# EAGLE design ATTinyAmpDriver (EAGLE 6.4)
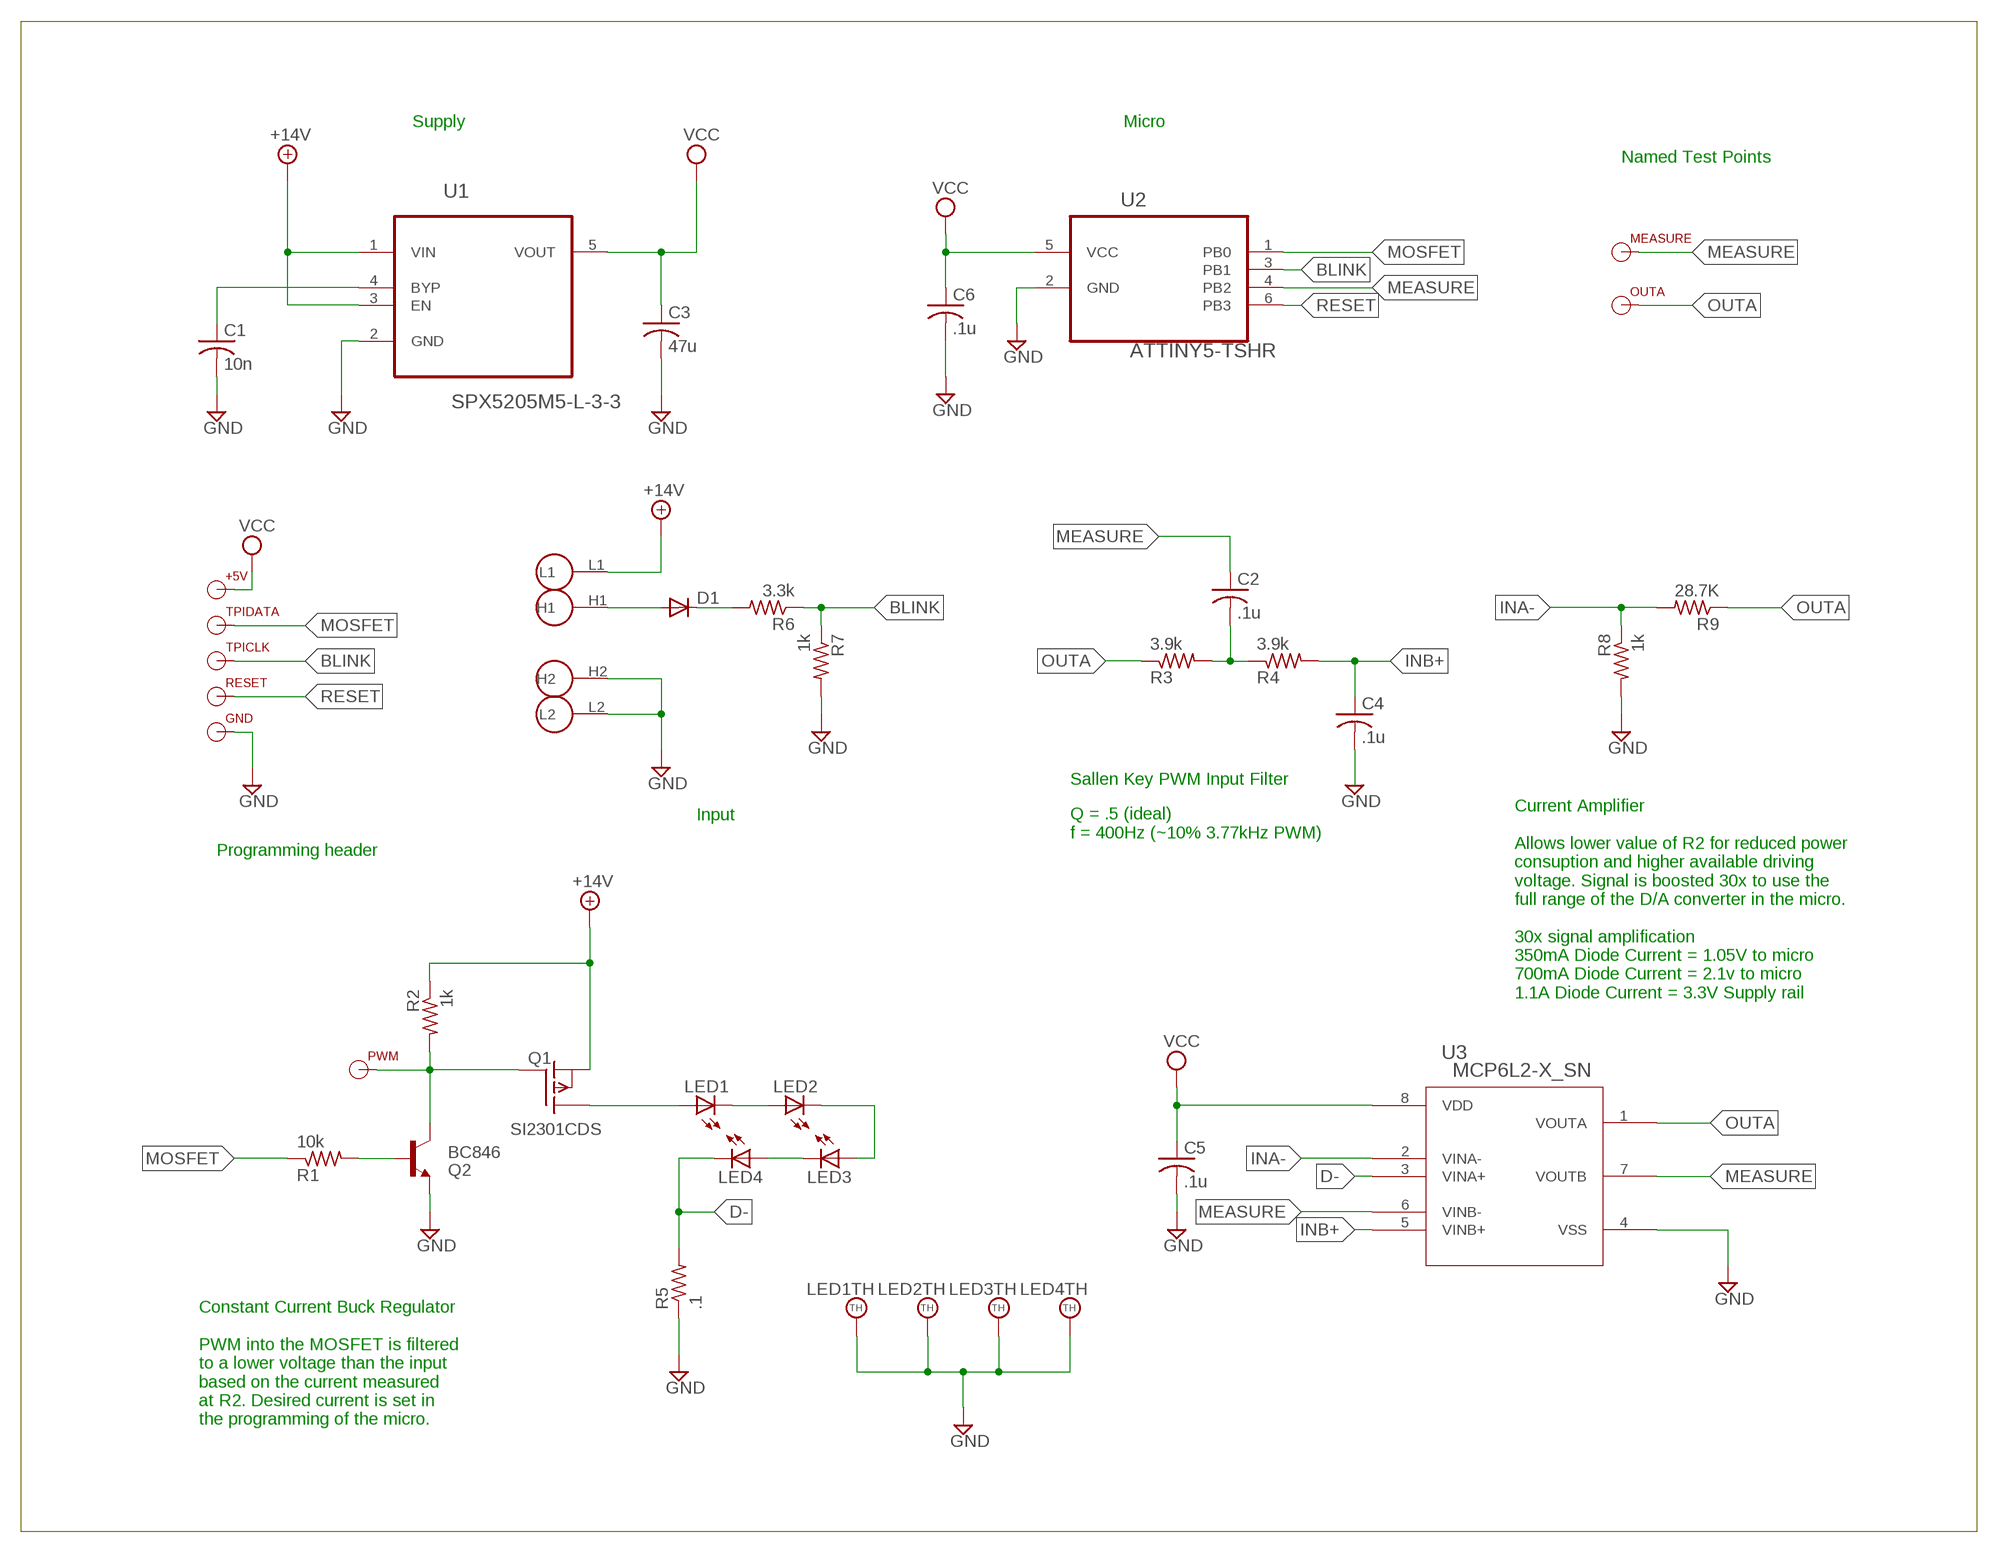
[diagram p0: schematic, sheet 1]

## Parts
+5V  TPI  [TPI_PAD]
C1  10n  C-USC0603  [C0603]
C2  .1u  C-USC0603  [C0603]
C3  47u  C-USC1206  [C1206]
C4  .1u  C-USC0603  [C0603]
C5  .1u  C-USC0603  [C0603]
C6  .1u  C-USC0603  [C0603]
D1  DIODE_0603  [D0603]
GND  TPI  [TPI_PAD]
LED1  LUXEON_REBELCREE_XP-E  [CREE_XP-E]
LED2  LUXEON_REBELCREE_XP-E  [CREE_XP-E]
LED3  LUXEON_REBELCREE_XP-E  [CREE_XP-E]
LED4  LUXEON_REBELCREE_XP-E  [CREE_XP-E]
MEASURE  TPI  [TPI_PAD]
OUTA  TPI  [TPI_PAD]
PWM  TPI  [TPI_PAD]
Q1  SI2301CDS  [SOT-23_POWER]
Q2  BC846  [SOT23]
R1  10k  R-US_R0603  [R0603]
R2  1k  R-US_R0603  [R0603]
R3  3.9k  R-US_R0603  [R0603]
R4  3.9k  R-US_R0603  [R0603]
R5  .1  R-US_R1206  [R1206]
R6  3.3k  R-US_R0603  [R0603]
R7  1k  R-US_R0603  [R0603]
R8  1k  R-US_R0603  [R0603]
R9  28.7K  R-US_R0603  [R0603]
RESET  TPI  [TPI_PAD]
TPICLK  TPI  [TPI_PAD]
TPIDATA  TPI  [TPI_PAD]
U1  SPX5205M5-L-3-3  [SOT95P280X145-5N]
U2  ATTINY5-TSHR  [SOT95P280X145-6N]
U3  MCP6L2-X_SN  [SOIC8-N_MC]
U$1  CON_TAILLIGHT  [TAILLIGHT]

## Nets
+14V: Q1.P$2(S) R2.1 U1.1(VIN) U1.3(EN) U$1.L1
BLINK: R6.1 R7.1 TPICLK.P$1(TPI_PIN) U2.3(PB1)
CROSSOVER: LED2.CT(C) LED3.AN(A)
D-: LED4.CT(C) R5.2 U3.3(VINA+)
GND: C1.2 C3.2 C4.2 C5.2 C6.2 GND.P$1(TPI_PIN) LED1.TH LED2.TH LED3.TH LED4.TH Q2.2(E) R5.1 R7.2 R8.2 U1.2(GND) U2.2(GND) U3.4(VSS) U$1.H2 U$1.L2
INA-: R8.1 R9.2 U3.2(VINA-)
INB+: C4.1 R4.2 U3.5(VINB+)
MEASURE: C2.1 MEASURE.P$1(TPI_PIN) U2.4(PB2) U3.6(VINB-) U3.7(VOUTB)
MOSFET: R1.1 TPIDATA.P$1(TPI_PIN) U2.1(PB0)
N$1: D1.1A(A) U$1.H1
N$2: C1.1 U1.4(BYP)
N$3: LED1.AN(A) Q1.P$3(D)
N$4: D1.2C(C) R6.2
N$5: PWM.P$1(TPI_PIN) Q1.P$1(G) Q2.3(C) R2.2
N$6: Q2.1(B) R1.2
N$7: LED1.CT(C) LED2.AN(A)
N$8: C2.2 R3.2 R4.1
N$10: LED3.CT(C) LED4.AN(A)
OUTA: OUTA.P$1(TPI_PIN) R3.1 R9.1 U3.1(VOUTA)
RESET: RESET.P$1(TPI_PIN) U2.6(PB3)
VCC: +5V.P$1(TPI_PIN) C3.1 C5.1 C6.1 U1.5(VOUT) U2.5(VCC) U3.8(VDD)

## Notes on the sheet
- Supply | Micro
- Named Test Points
- Sallen Key PWM Input Filter
- Input
- Q = .5 (ideal)
  f = 400Hz (~10% 3.77kHz PWM)
- Programming header
- Current Amplifier
  
  Allows lower value of R2 for reduced power
  consuption and higher available driving 
  voltage. Signal is boosted 30x to use the 
  full range of the D/A converter in the micro.
  
  30x signal amplification
  350mA Diode Current = 1.05V to micro
  700mA Diode Current = 2.1v to micro
  1.1A Diode Current = 3.3V Supply rail
- Constant Current Buck Regulator
  
  PWM into the MOSFET is filtered
  to a lower voltage than the input
  based on the current measured
  at R2. Desired current is set in
  the programming of the micro.

## Library data of the parts
+5V GND MEASURE OUTA PWM RESET TPICLK TPIDATA = Combined:TPI
C1 = resistor:C-US: CAPACITOR, American symbol; DIGIKEY: 445-1311-1-ND; DIGIKEY_COST: .10
C2 C4-C6 = resistor:C-US: CAPACITOR, American symbol; DIGIKEY: 445-1316-1-ND; DIGIKEY_COST: .10
C3 = resistor:C-US: CAPACITOR, American symbol; DIGIKEY: 399-5508-1-ND; DIGIKEY_COST: .67
D1 = Combined:DIODE_0603; DIGIKEY: 641-1002-1-ND; DIGIKEY_COST: .23
LED1-LED4 = Combined:LUXEON_REBEL: LUXEON Rebel Display layer 93, Pins, and connect all contact points with a net. The thermal pads are defined in a separate gate with addlevel REQUEST. Draw a net named 'TH' and connect all thermal pads with it. Please read the Package's Description about DRC settings. Source: http://www.lumileds.com/pdfs/AB32.pdf
Q1 = Combined:SI2301CDS; DIGIKEY: 568-6956-1-ND; DIGIKEY_COST: .69; NEWARK: 16P3701; NEWARK_COST: .37
Q2 = transistor-neu-to92:BC846: NPN TRANSISTOR; DIGIKEY: BC846BMTFCT-ND; DIGIKEY_COST: .17; NEWARK: 75R0728; NEWARK_COST: .14
R1 = resistor:R-US_: RESISTOR, American symbol; DIGIKEY: RMCF0603FT10K0CT-ND; DIGIKEY_COST: .04
R2 R7 R8 = resistor:R-US_: RESISTOR, American symbol; DIGIKEY: RMCF0603FT1K00CT-ND; DIGIKEY_COST: .04
R3 R4 = resistor:R-US_: RESISTOR, American symbol; DIGIKEY: RMCF0603FT3K90CT-ND; DIGIKEY_COST: .04
R5 = resistor:R-US_: RESISTOR, American symbol; DIGIKEY: A103268CT-ND; DIGIKEY_COST: .13
R6 = resistor:R-US_: RESISTOR, American symbol; DIGIKEY: RMCF0603FT3K30CT-ND; DIGIKEY_COST: .04
R9 = resistor:R-US_: RESISTOR, American symbol; DIGIKEY: RMCF0603FT28R7CT-ND; DIGIKEY_COST: .04
U1 = Exar_By_element14_Batch_1:SPX5205M5-L-3-3: 150mA, LOW-NOISE LDO VOLTAGE REGULATOR; DIGIKEY: 1016-1251-ND; DIGIKEY_COST: .60; MPN: SPX5205M5-L-3-3; OC_FARNELL: 1831954; OC_NEWARK: 23R9851; PACKAGE: SOT-23-5; SUPPLIER: EXAR
U2 = Atmel_By_element14_Batch_1:ATTINY5-TSHR: Microcontroller; DESCRIPTION: Microcontroller; DIGIKEY: ATTINY10-TSHRCT-ND; DIGIKEY_COST: .69; MPN: ATTINY5-TSHR; OC_FARNELL: 1841626; OC_NEWARK: 12T1342; PACKAGE: SOT563-6; SUPPLIER: ATMEL
U3 = Combined:MCP6L2-X_SN; DIGIKEY: MCP6L2T-E/SNCT-ND; DIGIKEY_COST: .64
U$1 = Combined:CON_TAILLIGHT

## Board
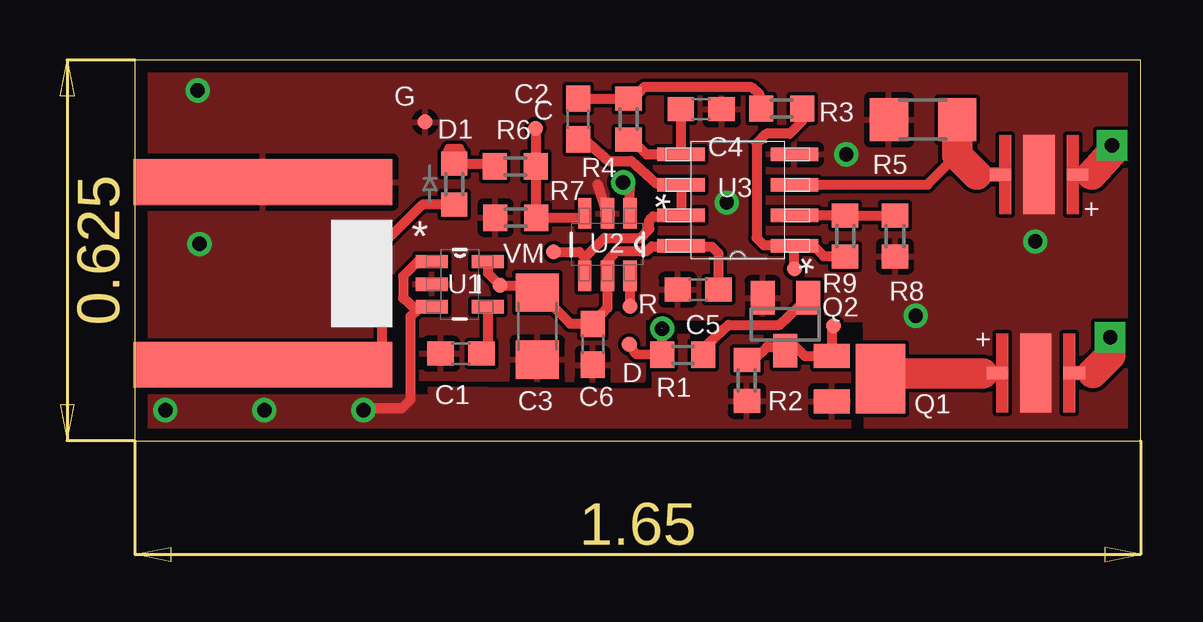
[diagram p1: board, top side]
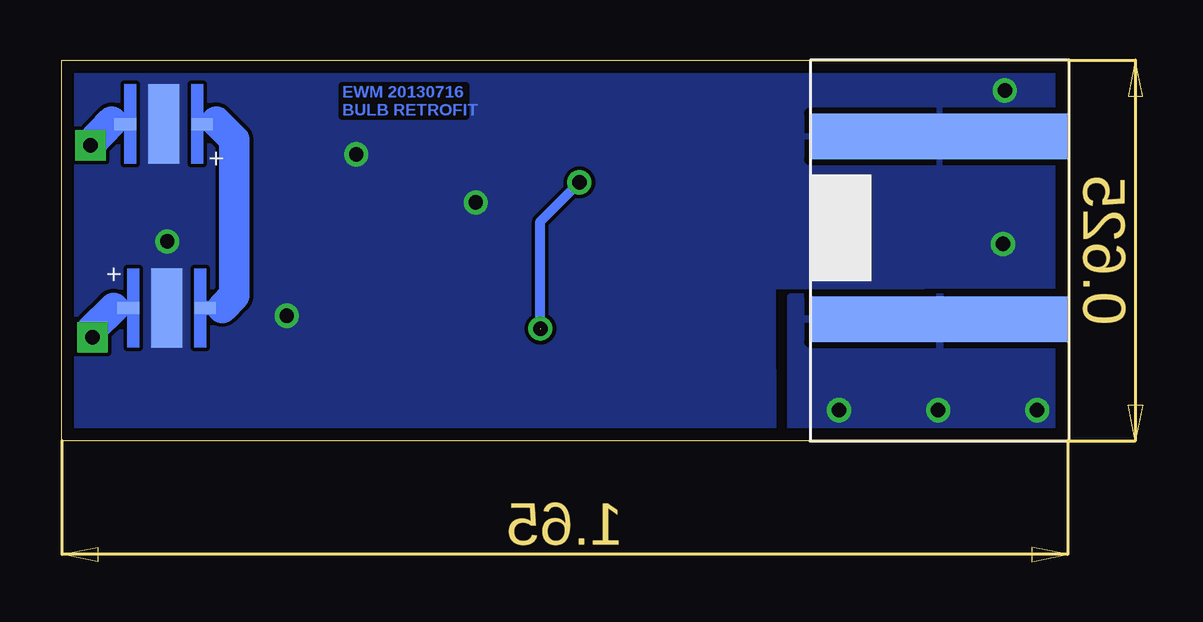
[diagram p2: board, bottom side, seen from below]

Size 41.91 x 15.88 mm. Coordinates in mm from the lower left corner, seen from the top.
Outline: 0,0 41.91,0 41.91,15.88 0,15.88 0,0
Copper layers (1*16): Top 0.035mm / dielectric 1.5mm / Bottom 0.035mm
Design rules "default *": minimum track width 6mil, minimum drill 10mil, track to track 6mil, track to pad 6mil, pad to pad 6mil, via to via 6mil, smd to smd 0mil, copper to edge 20mil, drill to drill 5mil, minimum pad ring 10mil, minimum via ring 8mil, stop-mask expansion 4mil, vias tented up to drill 0mil, thermal gap 10mil

### Footprints (pad centres in the part's own frame; a part is rotated, then mirrored left to right if it is on the bottom)
TPI_PAD = smd 0.635 x 0.635: P$1 0,0
C0603 = smd 1.1 x 1: 1 -0.85,0; 2 0.85,0
C1206 = smd 1.6 x 1.8: 1 -1.4,0; 2 1.4,0
D0603 = smd 1 x 1.1: 1A -0.85,0; 2C 0.85,0
CREE_XP-E = smd 0.9 x 0.5: AN -1.6,0; CT 1.6,0 | smd 1.3 x 3.3: TH 0,0
SOT-23_POWER = smd 1 x 1.5: P$1 -0.95,-2.025; P$2 0.95,-2.025 | smd 2.9 x 2.05: P$3 0,0
SOT23 = smd 1 x 1.4: 1 -0.95,-1.1; 2 0.95,-1.1; 3 0,1.1
R0603 = smd 1 x 1.1: 1 -0.85,0; 2 0.85,0
R1206 = smd 1.6 x 1.803: 1 -1.422,0; 2 1.422,0
SOT95P280X145-5N = smd 1.321 x 0.559: 1 -1.168,0.94; 2 -1.168,0; 3 -1.168,-0.94; 4 1.168,-0.94; 5 1.168,0.94
SOT95P280X145-6N = smd 1.27 x 0.559: 1 -1.295,0.94; 2 -1.295,0; 3 -1.295,-0.94; 4 1.295,-0.94; 5 1.295,0; 6 1.295,0.94
SOIC8-N_MC = smd 1.981 x 0.559: 1 -2.362,1.905; 2 -2.362,0.635; 3 -2.362,-0.635; 4 -2.362,-1.905; 5 2.362,-1.905; 6 2.362,-0.635; 7 2.362,0.635; 8 2.362,1.905
TAILLIGHT = smd 1.905 x 10.795 bottom: H1 -4.763,0; L2 2.857,0 | smd 1.905 x 10.795: H2 4.763,0; L1 -2.857,0

### Placement (x,y rotation side)
+5V  15.21,6.48 0 top
C1  13.59,3.63 180 top
C2  18.47,13.41 90 top
C3  16.76,4.78 270 top
C4  23.6,13.82 0 top
C5  23.47,6.3 180 top
C6  19.08,4.01 270 top
D1  13.31,10.69 90 top
GND  12.09,13.28 0 top
LED1  37.54,2.82 0 top
LED2  37.54,5.54 0 bottom
LED3  37.67,13.21 180 bottom
LED4  37.67,11.1 180 top
MEASURE  17.45,7.87 0 top
OUTA  27.48,7.16 0 top
PWM  29.11,4.8 0 top
Q1  31.06,2.59 270 top
Q2  27.1,4.85 180 top
R1  22.83,3.58 0 top
R2  25.5,2.51 90 top
R3  26.95,13.84 180 top
R4  20.57,13.41 270 top
R5  32.84,13.39 0 top
R6  15.85,11.43 180 top
R7  15.88,9.3 180 top
R8  31.67,8.53 270 top
R9  29.59,8.53 90 top
RESET  20.62,5.61 0 top
TPICLK  16.69,13.03 0 top
TPIDATA  20.6,4.01 0 top
U1  13.54,6.53 0 top
U2  19.68,8.18 270 top
U3  25.12,10.03 180 top
U$1  5.33,7.92 90 bottom

### Tracks (layer width: path | path; a pad name or v marks a point on that pad's centre or on a via)
+14V  (via drill 0.6)
  Top 0.406: U1.3 11.89,5.59 11.73,5.44 | 11.73,5.44 11.48,5.18 11.48,1.7 11.12,1.35 9.6,1.35 v9.53,1.27 | U1.1 11.79,7.47 11.18,6.86 11.18,5.94 11.73,5.44
  other vias: 1.27,1.27 5.4,1.27
  pour Top: -0.08,1.83 12.34,1.83 12.32,2.16 21.67,2.08 21.67,4.34 23.85,4.37 26.16,4.29 29.69,4.34 29.72,-0.15 -0.13,-0.1
  pour Bottom: -0.33,5.99 11.53,5.99 11.53,-0.28 -0.3,-0.28 -0.33,3.48
BLINK
  Top 0.406: 18.77,9.3 U2.3 18.75,9.3 R7.1 16.7,9.32 R6.1 TPICLK.P$1
CROSSOVER
  Bottom 0.61: LED3.AN 35.48,13.31 | 35.23,5.54 LED2.CT
  Bottom 1.27: 35.48,13.31 34.72,12.55 34.72,6.04 35.23,5.54
D-
  Top 0.406: U3.3 33.02,10.67 34.29,11.94 34.29,13.36 R5.2
  Top 0.61: LED4.CT 35.08,11.1
  Top 1.27: 35.08,11.1 34.26,11.91 R5.2
GND  (via drill 0.6)
  Top 0.406: U2.2 19.28,10.69
  other vias: 24.66,9.93 29.64,11.94 32.54,5.21 37.52,8.31 2.62,14.61 2.69,8.2
  pour Top: 0,15.85 41.91,15.9 41.94,8.74 41.99,5.61 41.96,4.52 41.91,0.03 30.51,-0.03 30.48,4.34 30.45,5.05 28.4,5.05 21.16,5.13 21.16,2.51 10.85,2.59 10.85,2.29 -0.03,2.31
  pour Bottom: -0.31,16.19 42.37,16.19 42.31,-0.58 12.25,-0.48 12.27,6.43 -0.33,6.48
INA-
  Top 0.406: U3.2 29.58,9.4 R9.2 R8.1
INB+
  Top 0.406: 22.72,11.98 U3.5 | C4.1 22.75,11.95 U3.5 | R4.2 20.69,12.56 21.31,11.94 U3.5
MEASURE
  Top 0.406: U2.4 18.75,7.64 | 18.75,7.64 19.56,8.46 21.06,8.46 21.44,8.84 21.44,9.2 21.59,9.35 22.71,9.35 U3.7 U3.6 22.71,10.72 21.72,10.72 20.68,11.66 19.74,11.66 18.73,12.56 C2.1 | MEASURE.P$1 18.52,7.87 18.75,7.64
MOSFET  (via drill 0.6)  (1 unrouted)
  Top 0.406: TPIDATA.P$1 20.89,3.6 R1.1 21.98,4.63 21.95,4.67 | U2.1 20.62,10.49 v20.34,10.77
  Bottom 0.406: v21.97,4.67 21.97,9.14 v20.34,10.77
N$1
  Top 0.406: D1.1A 11.98,9.84 10.29,8.15 10.29,3.35 10.06,3.12 5.37,3.12 U$1.H1
N$2
  Top 0.406: 14.58,3.34 C1.1 14.71,3.9 U1.4
N$3
  Top 0.61: LED1.AN 35.36,2.82 35.33,2.79
  Top 1.27: 35.33,2.79 31.27,2.79 Q1.P$3
N$4
  Top 0.406: D1.2C 14.89,11.54 R6.2
N$5
  Top 0.406: R2.2 25.77,3.34 26.34,3.91 26.94,3.91 Q2.3 27.54,3.9 27.91,3.53 Q1.P$1 29.04,4.8 PWM.P$1
N$6
  Top 0.406: R1.2 23.68,3.85 24.74,4.83 26.88,4.83 Q2.1
N$7  (via drill 0.6 pad 1.27)
  Top 0.61: LED1.CT 39.9,2.82
  Top 1.27: 39.9,2.82 40.64,3.56 v40.64,4.32
  Bottom 0.61: LED2.AN 39.75,5.54
  Bottom 1.27: 39.75,5.54 40.64,4.65 v40.64,4.32
N$8
  Top 0.406: C2.2 R4.1 20.76,14.26 21.23,14.76 25.68,14.76 26.04,14.43 26.04,13.91 R3.2
N$10  (via drill 0.6 pad 1.27)
  Top 0.61: LED4.AN 39.88,11.1
  Top 1.27: 39.88,11.1 40.69,11.99 v40.72,12.32
  Bottom 0.61: LED3.CT 39.83,13.31
  Bottom 1.27: 39.83,13.31 40.72,12.37 v40.72,12.32
OUTA
  Top 0.406: R3.1 27.8,13.32 27.28,12.8 26.31,12.8 25.91,12.39 25.91,8.46 26.21,8.15 27.46,8.15 U3.1 | U3.1 28.27,8.13 28.7,7.7 29.58,7.7 R9.1 | OUTA.P$1 U3.1
RESET
  Top 0.406: U2.6 RESET.P$1
VCC
  Top 0.406: C5.1 24.32,7.81 24.05,8.08 22.81,8.08 U3.8 22.73,8.1 21.54,8.1 21.31,7.9 20.07,7.9 19.68,7.49 U2.5 19.68,5.52 C6.1 19.06,4.88 18.14,4.88 16.84,6.17 C3.1 16.46,6.48 +5V.P$1 14.71,6.99 U1.5

### Text on the board
Bottom: EWM 20130716 / BULB RETROFIT
tNames: G | C | V | M | R | D